# Altium schematic sheet dmpro16-pcb-v1-MCU-Power.SchDoc
size A4; DocumentNumber: 13; SheetNumber: 13; SheetTotal: 17; SheetName: MCU-Power
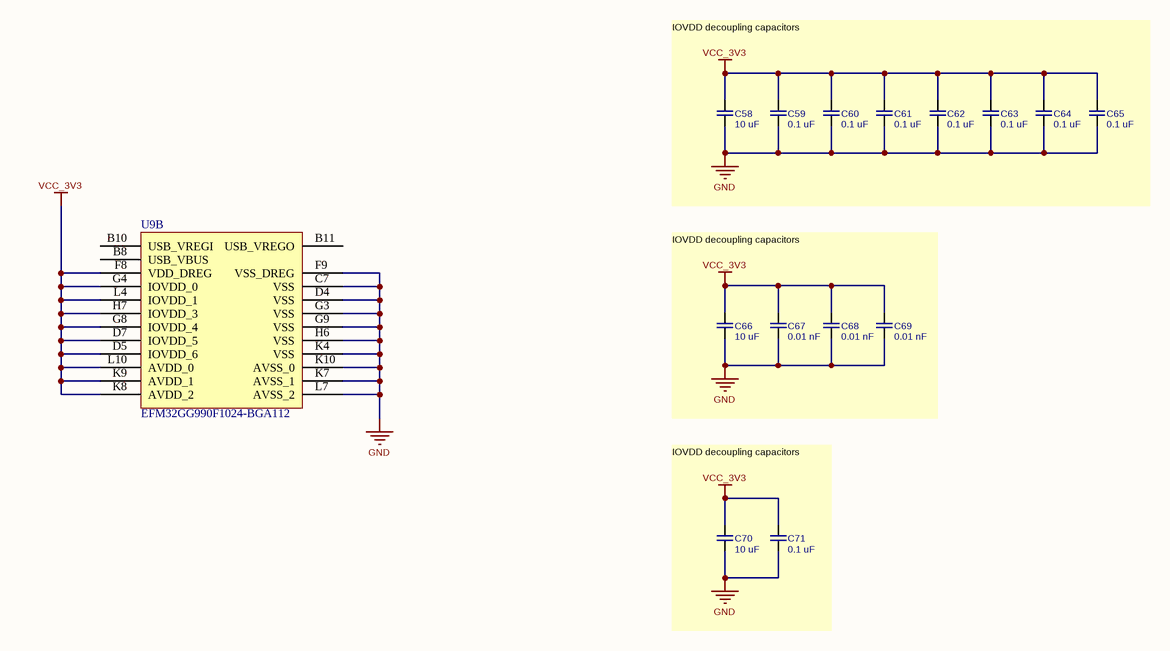
[diagram p0: dmpro16-pcb-v1-MCU-Power.SchDoc]

## Parts
C58  10 uF  [CAPC2012_0h50]
C59  0.1 uF  [CAPC2012_0h50]
C60  0.1 uF  [CAPC2012_0h50]
C61  0.1 uF  [CAPC2012_0h50]
C62  0.1 uF  [CAPC2012_0h50]
C63  0.1 uF  [CAPC2012_0h50]
C64  0.1 uF  [CAPC2012_0h50]
C65  0.1 uF  [CAPC2012_0h50]
C66  10 uF  [CAPC2012_0h50]
C67  0.01 nF  [CAPC2012_0h50]
C68  0.01 nF  [CAPC2012_0h50]
C69  0.01 nF  [CAPC2012_0h50]
C70  10 uF  [CAPC2012_0h50]
C71  0.1 uF  [CAPC2012_0h50]
U9  EFM32GG990F1024-BGA112  [ENMR-BGA112]  (part B of 2)

## Nets
GND: C58.1 C59.1 C60.1 C61.1 C62.1 C63.1 C64.1 C65.1 C66.1 C67.1 C68.1 C69.1 C70.1 C71.1 U9.C7(VSS) U9.D4(VSS) U9.F9(VSS_DREG) U9.G3(VSS) U9.G9(VSS) U9.H6(VSS) U9.K4(VSS) U9.K7(AVSS_1) U9.K10(AVSS_0) U9.L7(AVSS_2)
VCC_3V3: C58.2 C59.2 C60.2 C61.2 C62.2 C63.2 C64.2 C65.2 C66.2 C67.2 C68.2 C69.2 C70.2 C71.2 U9.D5(IOVDD_6) U9.D7(IOVDD_5) U9.F8(VDD_DREG) U9.G4(IOVDD_0) U9.G8(IOVDD_4) U9.H7(IOVDD_3) U9.K8(AVDD_2) U9.K9(AVDD_1) U9.L4(IOVDD_1) U9.L10(AVDD_0)

Not connected (* = marked no-connect by the designer): U9 B8(USB_VBUS) B10(USB_VREGI) B11(USB_VREGO)

## Notes on the sheet
- IOVDD decoupling capacitors
- Board:
- Version:
- Sheetname:
- Subject:
- Group:
- Sheet
- of
- Shematic file:

## Library data of the parts
C58 C66 C70 = cap_unpol_1608_10uF: 10 uF unpolarized capacitor (1608 size); Voltage Rating: 6.3 V; Body Size (metric): 1608; Ideal Value: 10 uF
C59-C65 C71 = cap_unpol_1608_0.1uF: 0.1 uF unpolarized capacitor (1608 size); Voltage Rating: 6.3 V; Body Size (metric): 1608; Ideal Value: 0.1 uF
C67-C69 = cap_unpol_1608_0.01uF: 0.01 uF unpolarized capacitor (1608 size); Voltage Rating: 6.3 V; Body Size (metric): 1608; Ideal Value: 0.01 nF
U9 = EFM32GG990F1024-BGA112: EFM32 Giant Gecko, M3 ARM Cortex CPU, 1024 KB Flash, 128 KB RAM, 1.85 - 3.8 V Supply, 48 MHz Max Speed, -40 to 85 degC, 112-Pin BGA, RoHS Compliant; Flash (KB): 1024; GPIO: 87; LCD: 8x34; LESENSE: Y; Max Speed (MHz): 48; OPAMPS: 3; RAM (KB): 128; DatasheetVersion: Rev 1.00; PackageVersion: Rev. 97SPP01315A_X03_06Jun11; PackageReference: BGA112; PackageDescription: 112-Pin Ball Grid Array, Body 10 x 10 mm, Pitch 0.8 mm; Supplier 1: Digi-Key; Supplier Part Number 1: 914-1051-2-ND; Supplier 2: Digi-Key; Supplier Part Number 2: 914-1051-1-ND; Supplier 3: Digi-Key; Supplier Part Number 3: 914-1051-6-ND; Supplier 4: Mouser; Supplier Part Number 4: 904-EFM32GG990F1024; ARM Cortex CPU: M3; Subcategory: EFM32 Giant Gecko; Supply Voltage (V): 1.85 - 3.8; USB: Y; Mounting Technology: Surface Mount; Generic Part Number: EFM32GG990; PartNumber: EFM32GG990F1024-BGA112; ComponentLink1Description: Manufacturer URL; ComponentLink1URL: http://www.energymicro.com/; ComponentLink2Description: Datasheet; ComponentLink2URL: http://cdn.energymicro.com/dl/devices/pdf/d0046_efm32gg990_datasheet.pdf; ComponentLink3Description: Package Specification; ComponentLink3URL: http://cdn.energymicro.com/dl/devices/pdf/d0007_efm32g290_datasheet.pdf